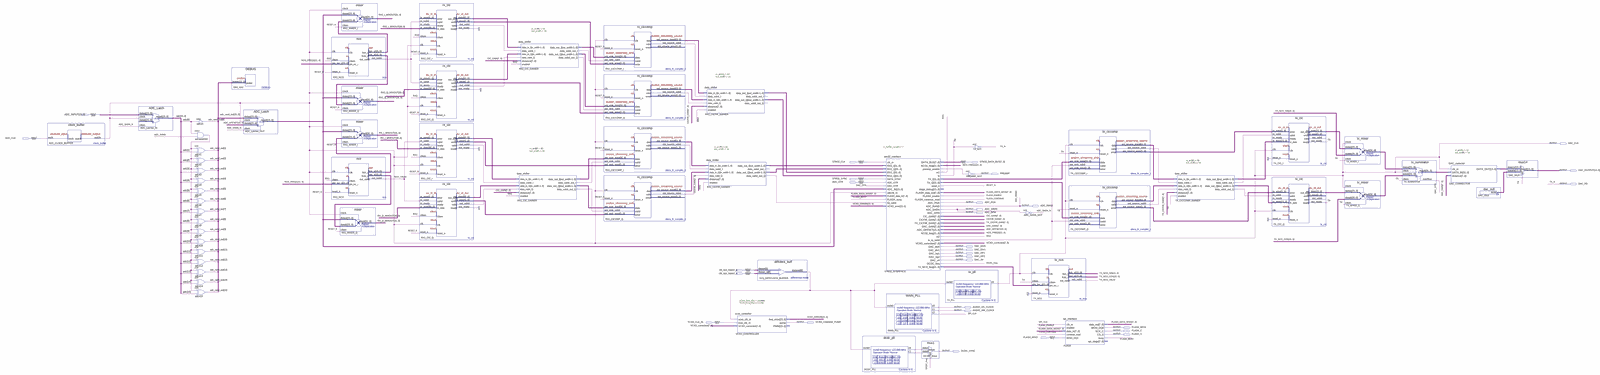
[diagram p0: schematic sheet, whole]
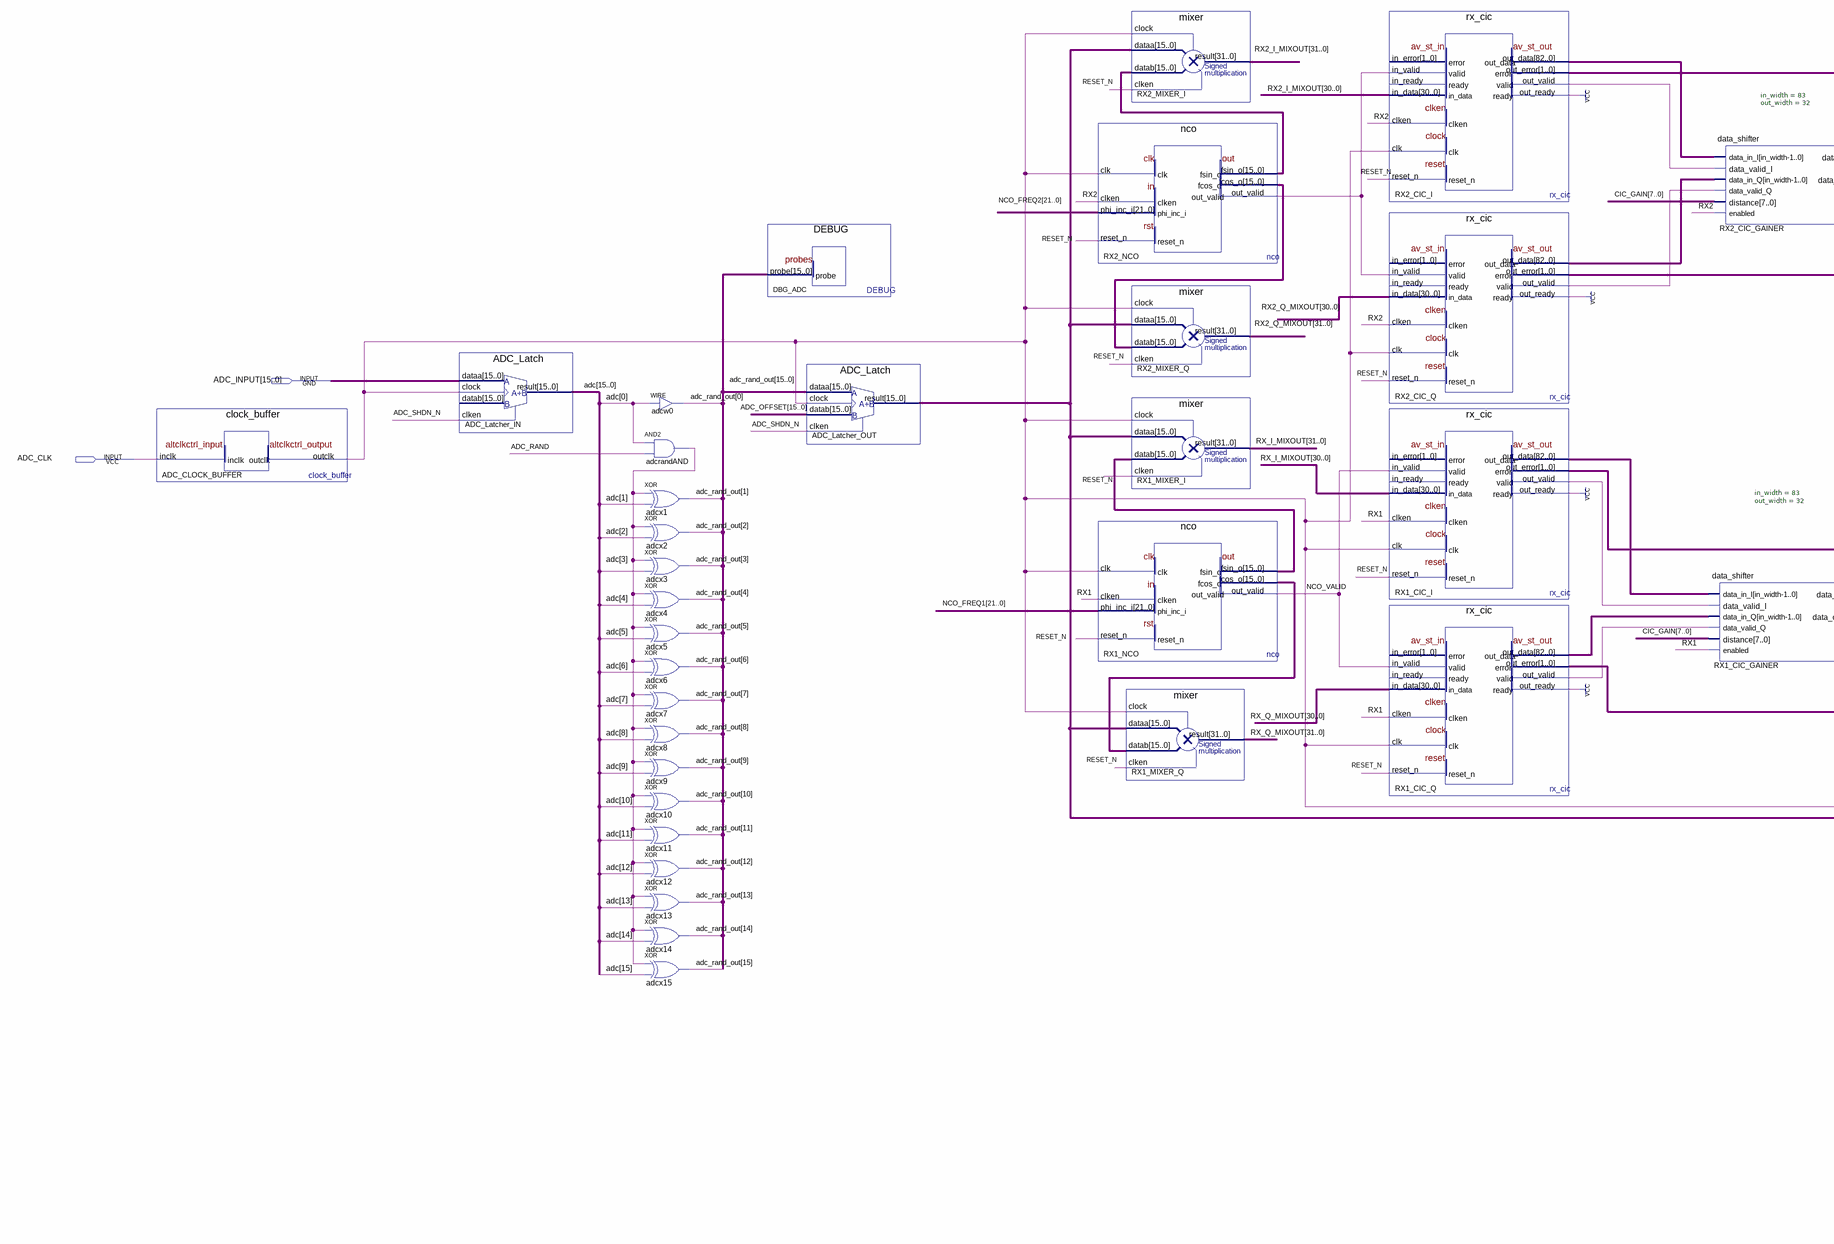
[diagram p1: schematic sheet, left part]
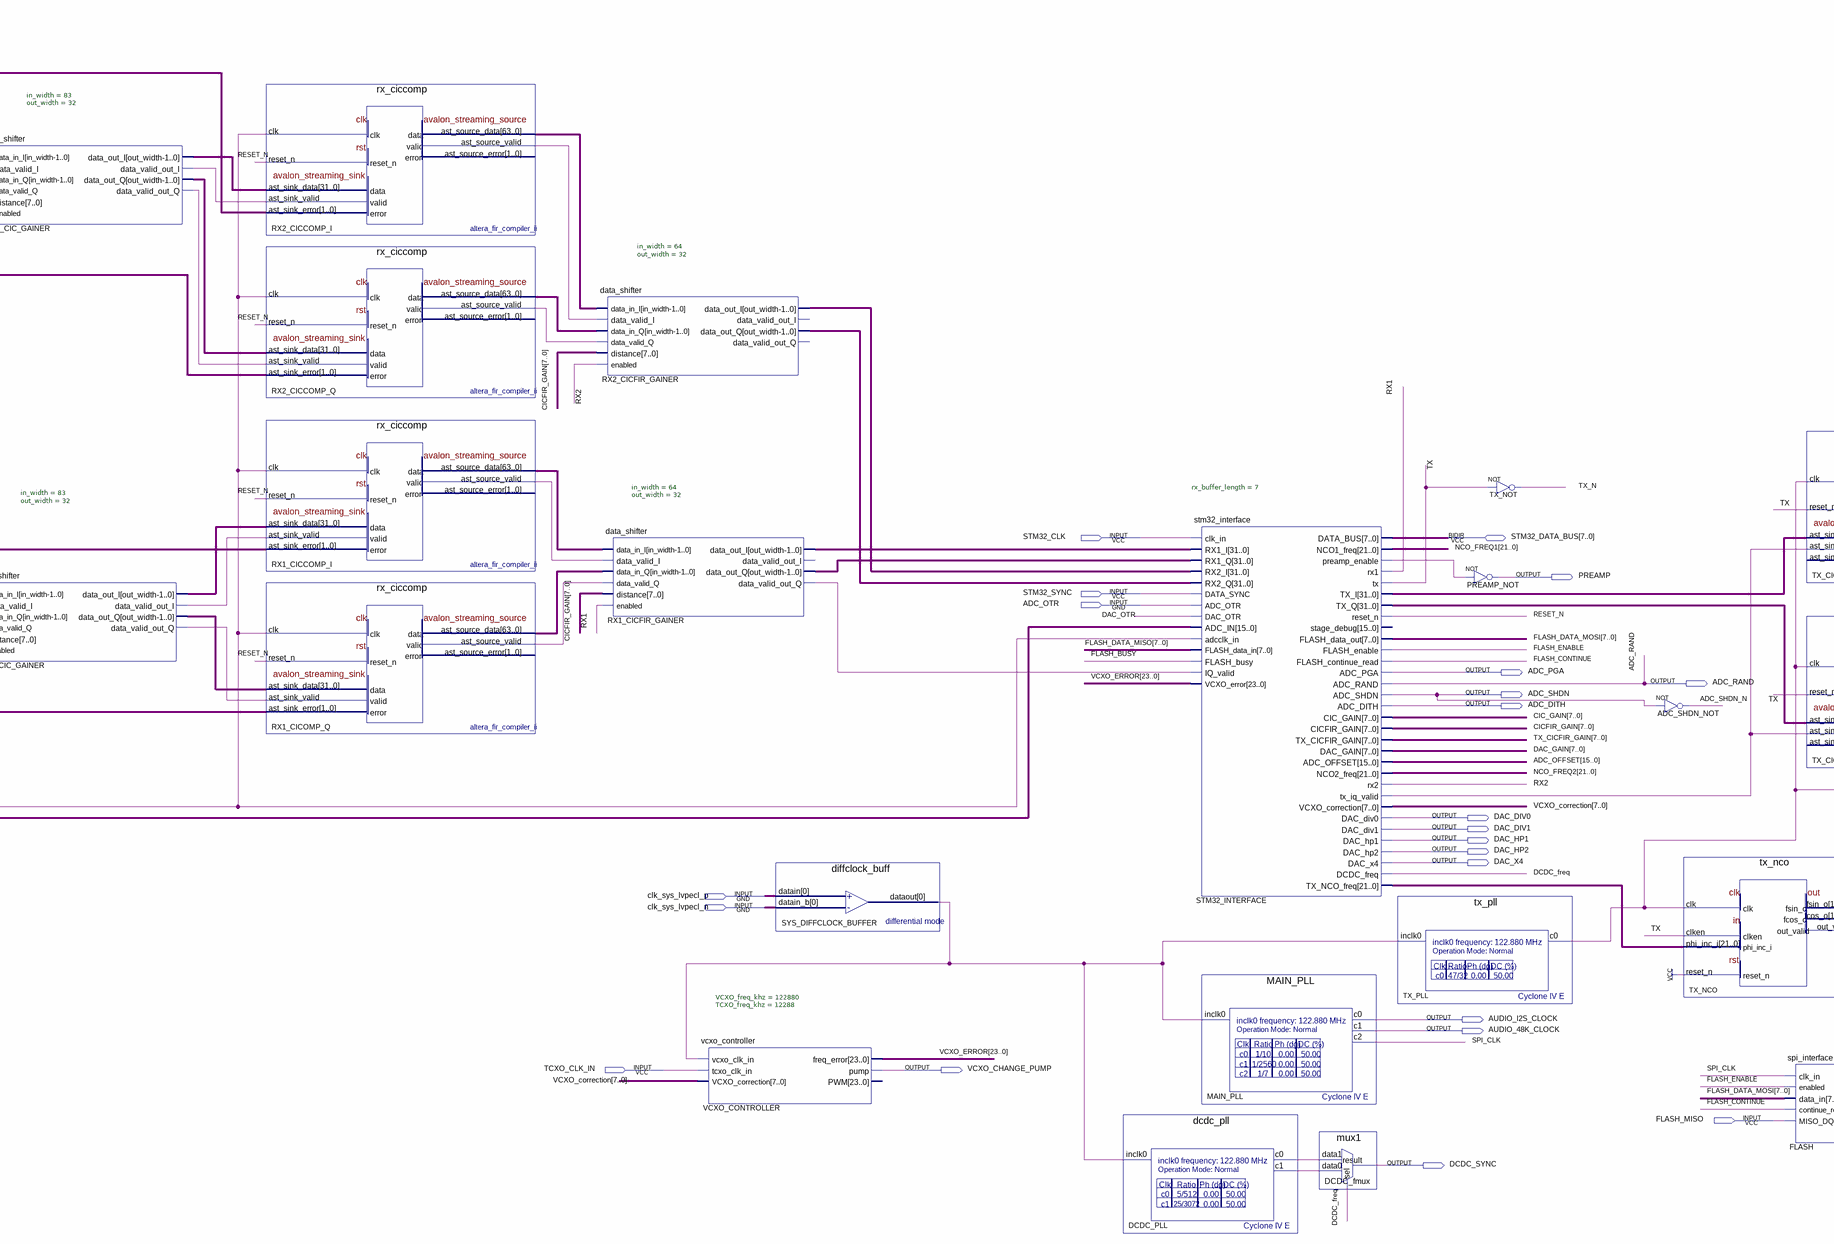
[diagram p2: schematic sheet, centre part]
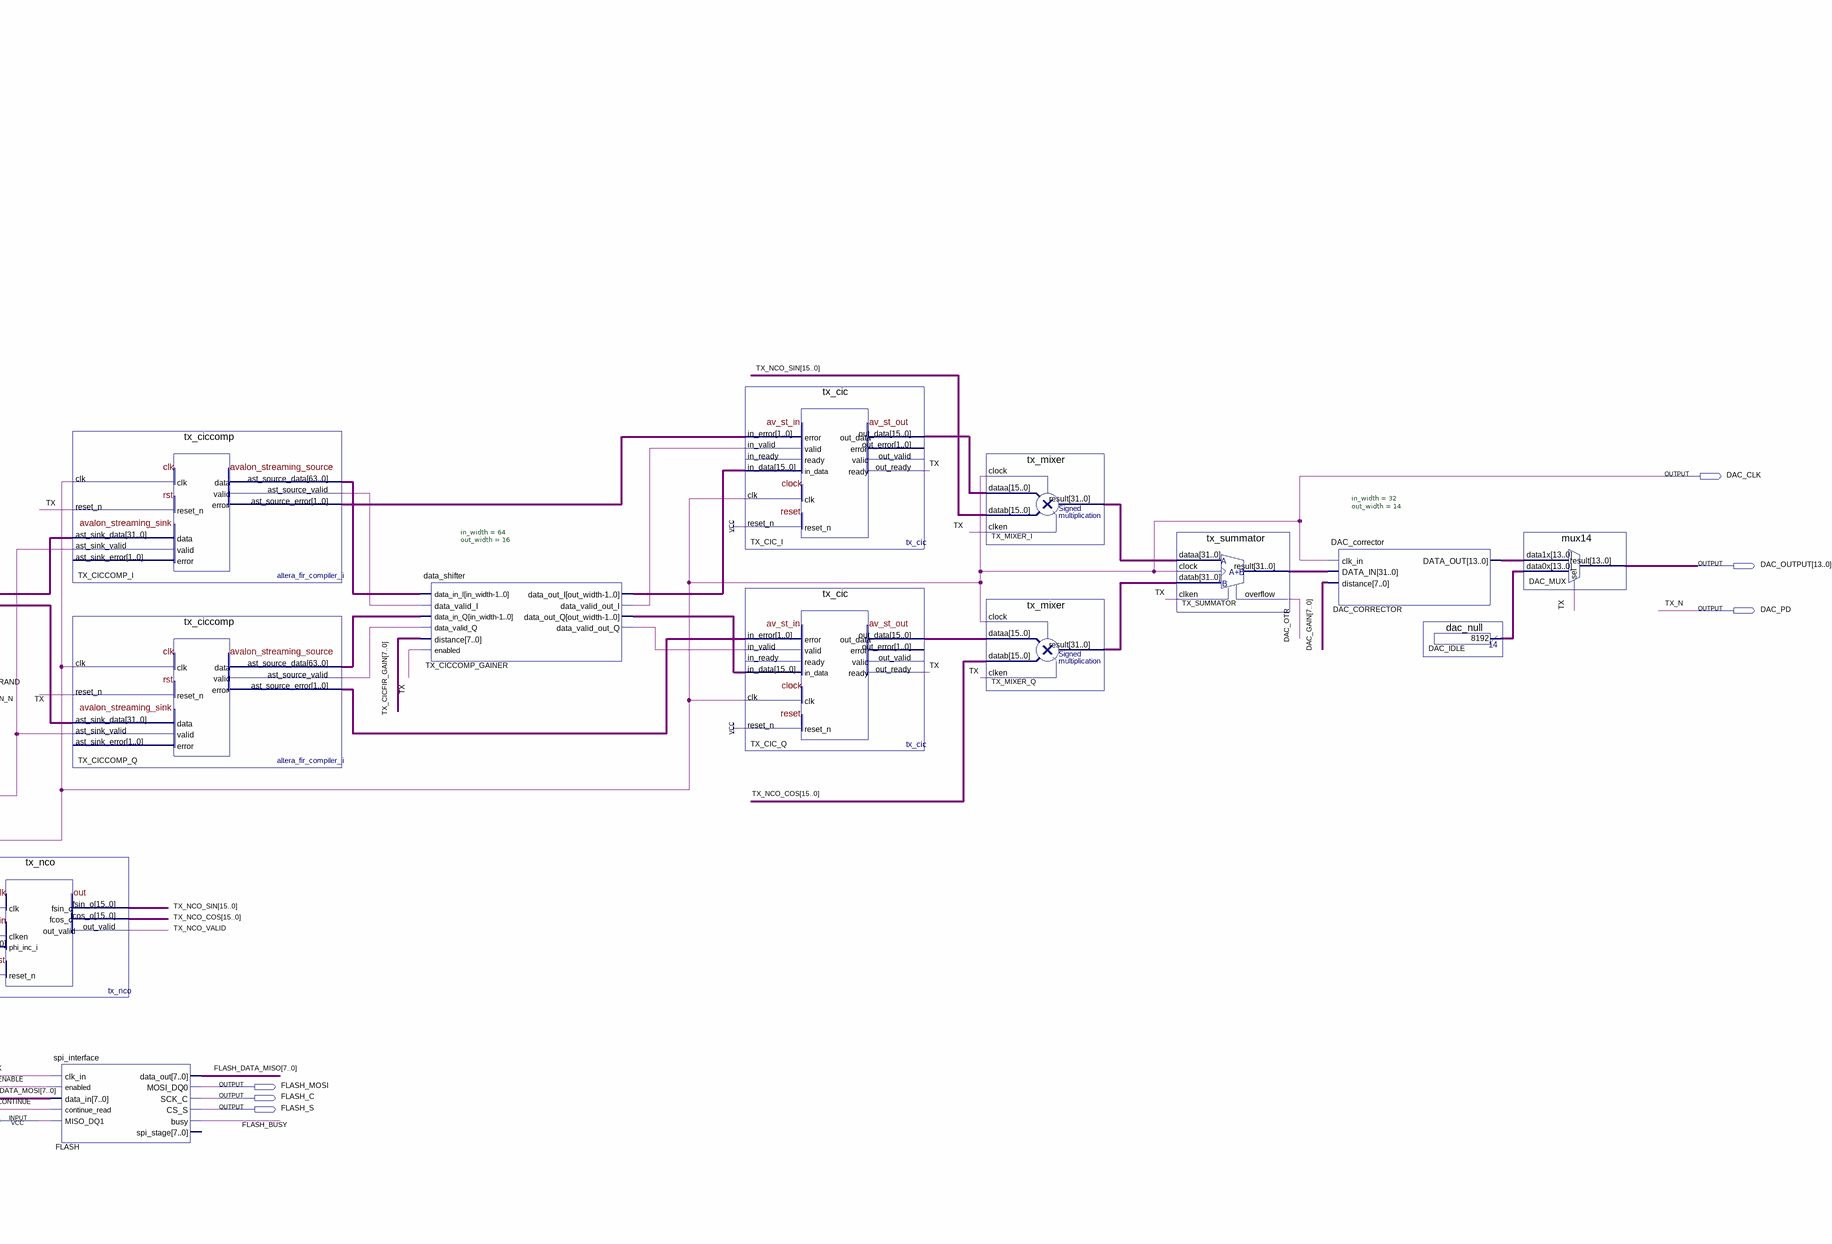
[diagram p3: schematic sheet, right part]
// Quartus schematic UA3REO.bdf as structural Verilog: 62 symbols, 30 pins
module UA3REO (
  input  [15:0] ADC_INPUT,
  input  ADC_CLK,
  input  STM32_CLK,
  input  STM32_SYNC,
  input  ADC_OTR,
  input  clk_sys_lvpecl_p,
  input  clk_sys_lvpecl_n,
  input  TCXO_CLK_IN,
  input  FLASH_MISO,
  inout  [7:0] STM32_DATA_BUS,
  output DAC_CLK,
  output [13:0] DAC_OUTPUT,
  output PREAMP,
  output DAC_PD,
  output ADC_PGA,
  output ADC_RAND,
  output ADC_SHDN,
  output ADC_DITH,
  output DAC_DIV0,
  output DAC_DIV1,
  output DAC_HP1,
  output DAC_HP2,
  output DAC_X4,
  output AUDIO_I2S_CLOCK,
  output AUDIO_48K_CLOCK,
  output VCXO_CHANGE_PUMP,
  output FLASH_MOSI,
  output FLASH_C,
  output FLASH_S,
  output DCDC_SYNC
);

  wire ADC_CLOCK_BUFFER_outclk, ADC_SHDN_N, adcrandAND_out, DAC_OTR, DCDC_freq, DCDC_PLL_c0, DCDC_PLL_c1,
       FLASH_BUSY, FLASH_CONTINUE, FLASH_ENABLE, NCO_VALID, RESET_N, RX1, RX1_CIC_GAINER_data_valid_out_i,
       RX1_CIC_GAINER_data_valid_out_q, RX1_CIC_I_out_valid, RX1_CIC_Q_out_valid,
       RX1_CICCOMP_I_ast_source_valid, RX1_CICFIR_GAINER_data_valid_out_q, RX1_CICOMP_Q_ast_source_valid,
       RX2, RX2_CIC_GAINER_data_valid_out_i, RX2_CIC_GAINER_data_valid_out_q, RX2_CIC_I_out_valid,
       RX2_CIC_Q_out_valid, RX2_CICCOMP_I_ast_source_valid, RX2_CICCOMP_Q_ast_source_valid,
       RX2_NCO_out_valid, SPI_CLK, STM32_INTERFACE_preamp_enable, STM32_INTERFACE_tx_iq_valid,
       SYS_DIFFCLOCK_BUFFER_dataout, TX, TX_CICCOMP_GAINER_data_valid_out_i,
       TX_CICCOMP_GAINER_data_valid_out_q, TX_CICCOMP_I_ast_source_valid, TX_CICCOMP_Q_ast_source_valid,
       TX_NCO_VALID;
  wire [1:0] RX1_CIC_I_out_error, RX1_CIC_Q_out_error, RX2_CIC_I_out_error, RX2_CIC_Q_out_error,
       TX_CICCOMP_I_ast_source_error, TX_CICCOMP_Q_ast_source_error;
  wire [7:0] CIC_GAIN, CICFIR_GAIN, DAC_GAIN, FLASH_DATA_MISO, FLASH_DATA_MOSI, TX_CICFIR_GAIN,
       VCXO_correction;
  wire [13:0] DAC_CORRECTOR_data_out, DAC_IDLE_result;
  wire [15:0] adc, ADC_Latcher_OUT_result, ADC_OFFSET, adc_rand_out, RX1_NCO_fcos_o, RX1_NCO_fsin_o,
       RX2_NCO_fcos_o, RX2_NCO_fsin_o, TX_CIC_I_out_data, TX_CIC_Q_out_data, TX_CICCOMP_GAINER_data_out_i,
       TX_CICCOMP_GAINER_data_out_q, TX_NCO_COS, TX_NCO_SIN;
  wire [21:0] NCO_FREQ1, NCO_FREQ2, STM32_INTERFACE_tx_nco_freq;
  wire [23:0] VCXO_ERROR;
  wire [31:0] RX1_CIC_GAINER_data_out_i, RX1_CIC_GAINER_data_out_q, RX1_CICFIR_GAINER_data_out_i,
       RX1_CICFIR_GAINER_data_out_q, RX2_CIC_GAINER_data_out_i, RX2_CIC_GAINER_data_out_q,
       RX2_CICFIR_GAINER_data_out_i, RX2_CICFIR_GAINER_data_out_q, RX2_I_MIXOUT, RX2_Q_MIXOUT, RX_I_MIXOUT,
       RX_Q_MIXOUT, STM32_INTERFACE_tx_i, STM32_INTERFACE_tx_q, TX_MIXER_I_result, TX_MIXER_Q_result,
       TX_SUMMATOR_result;
  wire [63:0] RX1_CICCOMP_I_ast_source_data, RX1_CICOMP_Q_ast_source_data, RX2_CICCOMP_I_ast_source_data,
       RX2_CICCOMP_Q_ast_source_data, TX_CICCOMP_I_ast_source_data, TX_CICCOMP_Q_ast_source_data;
  wire [82:0] RX1_CIC_I_out_data, RX1_CIC_Q_out_data, RX2_CIC_I_out_data, RX2_CIC_Q_out_data;

  clock_buffer ADC_CLOCK_BUFFER (.inclk(ADC_CLK), .outclk(ADC_CLOCK_BUFFER_outclk));
  ADC_Latch ADC_Latcher_IN (
    .dataa(ADC_INPUT), .clken(ADC_SHDN_N), .clock(ADC_CLOCK_BUFFER_outclk), .result(adc));  // open: datab
  assign adc_rand_out[0] = adc[0];  // WIRE adcw0
  and adcrandAND (adcrandAND_out, adc[0], ADC_RAND);
  xor adcx1 (adc_rand_out[1], adcrandAND_out, adc[1]);
  xor adcx2 (adc_rand_out[2], adcrandAND_out, adc[2]);
  xor adcx3 (adc_rand_out[3], adcrandAND_out, adc[3]);
  xor adcx4 (adc_rand_out[4], adcrandAND_out, adc[4]);
  xor adcx5 (adc_rand_out[5], adcrandAND_out, adc[5]);
  xor adcx6 (adc_rand_out[6], adcrandAND_out, adc[6]);
  xor adcx7 (adc_rand_out[7], adcrandAND_out, adc[7]);
  xor adcx8 (adc_rand_out[8], adcrandAND_out, adc[8]);
  xor adcx9 (adc_rand_out[9], adcrandAND_out, adc[9]);
  xor adcx10 (adc_rand_out[10], adcrandAND_out, adc[10]);
  xor adcx11 (adc_rand_out[11], adcrandAND_out, adc[11]);
  xor adcx12 (adc_rand_out[12], adcrandAND_out, adc[12]);
  xor adcx13 (adc_rand_out[13], adcrandAND_out, adc[13]);
  xor adcx14 (adc_rand_out[14], adcrandAND_out, adc[14]);
  xor adcx15 (adc_rand_out[15], adcrandAND_out, adc[15]);
  DEBUG DBG_ADC (.probe(adc_rand_out));
  ADC_Latch ADC_Latcher_OUT (
    .dataa(adc_rand_out), .datab(ADC_OFFSET), .clken(ADC_SHDN_N), .clock(ADC_CLOCK_BUFFER_outclk),
    .result(ADC_Latcher_OUT_result));
  nco RX2_NCO (
    .clk(ADC_CLOCK_BUFFER_outclk), .clken(RX2), .phi_inc_i(NCO_FREQ2), .reset_n(RESET_N),
    .fsin_o(RX2_NCO_fsin_o), .fcos_o(RX2_NCO_fcos_o), .out_valid(RX2_NCO_out_valid));
  nco RX1_NCO (
    .clk(ADC_CLOCK_BUFFER_outclk), .clken(RX1), .phi_inc_i(NCO_FREQ1), .reset_n(RESET_N),
    .fsin_o(RX1_NCO_fsin_o), .fcos_o(RX1_NCO_fcos_o), .out_valid(NCO_VALID));
  mixer RX2_MIXER_I (
    .clock(ADC_CLOCK_BUFFER_outclk), .dataa(ADC_Latcher_OUT_result), .datab(RX2_NCO_fsin_o), .clken(RESET_N),
    .result(RX2_I_MIXOUT));
  mixer RX2_MIXER_Q (
    .clock(ADC_CLOCK_BUFFER_outclk), .dataa(ADC_Latcher_OUT_result), .datab(RX2_NCO_fcos_o), .clken(RESET_N),
    .result(RX2_Q_MIXOUT));
  mixer RX1_MIXER_I (
    .clock(ADC_CLOCK_BUFFER_outclk), .dataa(ADC_Latcher_OUT_result), .datab(RX1_NCO_fsin_o), .clken(RESET_N),
    .result(RX_I_MIXOUT));
  mixer RX1_MIXER_Q (
    .clock(ADC_CLOCK_BUFFER_outclk), .dataa(ADC_Latcher_OUT_result), .datab(RX1_NCO_fcos_o), .clken(RESET_N),
    .result(RX_Q_MIXOUT));
  rx_cic RX2_CIC_I (
    .in_valid(RX2_NCO_out_valid), .in_data(RX2_I_MIXOUT[30:0]), .out_ready(1'b1), .clken(RX2),
    .clk(ADC_CLOCK_BUFFER_outclk), .reset_n(RESET_N), .out_data(RX2_CIC_I_out_data),
    .out_error(RX2_CIC_I_out_error), .out_valid(RX2_CIC_I_out_valid));  // open: in_error, in_ready
  rx_cic RX2_CIC_Q (
    .in_valid(RX2_NCO_out_valid), .in_data(RX2_Q_MIXOUT[30:0]), .out_ready(1'b1), .clken(RX2),
    .clk(ADC_CLOCK_BUFFER_outclk), .reset_n(RESET_N), .out_data(RX2_CIC_Q_out_data),
    .out_error(RX2_CIC_Q_out_error), .out_valid(RX2_CIC_Q_out_valid));  // open: in_error, in_ready
  rx_cic RX1_CIC_I (
    .in_valid(NCO_VALID), .in_data(RX_I_MIXOUT[30:0]), .out_ready(1'b1), .clken(RX1),
    .clk(ADC_CLOCK_BUFFER_outclk), .reset_n(RESET_N), .out_data(RX1_CIC_I_out_data),
    .out_error(RX1_CIC_I_out_error), .out_valid(RX1_CIC_I_out_valid));  // open: in_error, in_ready
  rx_cic RX1_CIC_Q (
    .in_valid(NCO_VALID), .in_data(RX_Q_MIXOUT[30:0]), .out_ready(1'b1), .clken(RX1),
    .clk(ADC_CLOCK_BUFFER_outclk), .reset_n(RESET_N), .out_data(RX1_CIC_Q_out_data),
    .out_error(RX1_CIC_Q_out_error), .out_valid(RX1_CIC_Q_out_valid));  // open: in_error, in_ready
  data_shifter #(.in_width(83), .out_width(32)) RX2_CIC_GAINER (
    .data_in_I(RX2_CIC_I_out_data), .data_valid_I(RX2_CIC_I_out_valid), .data_in_Q(RX2_CIC_Q_out_data),
    .data_valid_Q(RX2_CIC_Q_out_valid), .distance(CIC_GAIN), .enabled(RX2),
    .data_out_I(RX2_CIC_GAINER_data_out_i), .data_valid_out_I(RX2_CIC_GAINER_data_valid_out_i),
    .data_out_Q(RX2_CIC_GAINER_data_out_q), .data_valid_out_Q(RX2_CIC_GAINER_data_valid_out_q));
  data_shifter #(.in_width(83), .out_width(32)) RX1_CIC_GAINER (
    .data_in_I(RX1_CIC_I_out_data), .data_valid_I(RX1_CIC_I_out_valid), .data_in_Q(RX1_CIC_Q_out_data),
    .data_valid_Q(RX1_CIC_Q_out_valid), .distance(CIC_GAIN), .enabled(RX1),
    .data_out_I(RX1_CIC_GAINER_data_out_i), .data_valid_out_I(RX1_CIC_GAINER_data_valid_out_i),
    .data_out_Q(RX1_CIC_GAINER_data_out_q), .data_valid_out_Q(RX1_CIC_GAINER_data_valid_out_q));
  rx_ciccomp RX2_CICCOMP_I (
    .clk(ADC_CLOCK_BUFFER_outclk), .reset_n(RESET_N), .ast_sink_data(RX2_CIC_GAINER_data_out_i),
    .ast_sink_valid(RX2_CIC_GAINER_data_valid_out_i), .ast_sink_error(RX2_CIC_I_out_error),
    .ast_source_data(RX2_CICCOMP_I_ast_source_data), .ast_source_valid(RX2_CICCOMP_I_ast_source_valid));  // open: ast_source_error
  rx_ciccomp RX2_CICCOMP_Q (
    .clk(ADC_CLOCK_BUFFER_outclk), .reset_n(RESET_N), .ast_sink_data(RX2_CIC_GAINER_data_out_q),
    .ast_sink_valid(RX2_CIC_GAINER_data_valid_out_q), .ast_sink_error(RX2_CIC_Q_out_error),
    .ast_source_data(RX2_CICCOMP_Q_ast_source_data), .ast_source_valid(RX2_CICCOMP_Q_ast_source_valid));  // open: ast_source_error
  rx_ciccomp RX1_CICCOMP_I (
    .clk(ADC_CLOCK_BUFFER_outclk), .reset_n(RESET_N), .ast_sink_data(RX1_CIC_GAINER_data_out_i),
    .ast_sink_valid(RX1_CIC_GAINER_data_valid_out_i), .ast_sink_error(RX1_CIC_I_out_error),
    .ast_source_data(RX1_CICCOMP_I_ast_source_data), .ast_source_valid(RX1_CICCOMP_I_ast_source_valid));  // open: ast_source_error
  rx_ciccomp RX1_CICOMP_Q (
    .clk(ADC_CLOCK_BUFFER_outclk), .reset_n(RESET_N), .ast_sink_data(RX1_CIC_GAINER_data_out_q),
    .ast_sink_valid(RX1_CIC_GAINER_data_valid_out_q), .ast_sink_error(RX1_CIC_Q_out_error),
    .ast_source_data(RX1_CICOMP_Q_ast_source_data), .ast_source_valid(RX1_CICOMP_Q_ast_source_valid));  // open: ast_source_error
  data_shifter #(.in_width(64), .out_width(32)) RX2_CICFIR_GAINER (
    .data_in_I(RX2_CICCOMP_I_ast_source_data), .data_valid_I(RX2_CICCOMP_I_ast_source_valid),
    .data_in_Q(RX2_CICCOMP_Q_ast_source_data), .data_valid_Q(RX2_CICCOMP_Q_ast_source_valid),
    .distance(CICFIR_GAIN), .enabled(RX2), .data_out_I(RX2_CICFIR_GAINER_data_out_i),
    .data_out_Q(RX2_CICFIR_GAINER_data_out_q));  // open: data_valid_out_I, data_valid_out_Q
  data_shifter #(.in_width(64), .out_width(32)) RX1_CICFIR_GAINER (
    .data_in_I(RX1_CICCOMP_I_ast_source_data), .data_valid_I(RX1_CICCOMP_I_ast_source_valid),
    .data_in_Q(RX1_CICOMP_Q_ast_source_data), .data_valid_Q(RX1_CICOMP_Q_ast_source_valid),
    .distance(CICFIR_GAIN), .enabled(RX1), .data_out_I(RX1_CICFIR_GAINER_data_out_i),
    .data_out_Q(RX1_CICFIR_GAINER_data_out_q), .data_valid_out_Q(RX1_CICFIR_GAINER_data_valid_out_q));  // open: data_valid_out_I
  vcxo_controller #(.VCXO_freq_khz(122880), .TCXO_freq_khz(12288)) VCXO_CONTROLLER (
    .vcxo_clk_in(SYS_DIFFCLOCK_BUFFER_dataout), .tcxo_clk_in(TCXO_CLK_IN), .VCXO_correction(VCXO_correction),
    .freq_error(VCXO_ERROR), .pump(VCXO_CHANGE_PUMP));  // open: PWM
  diffclock_buff SYS_DIFFCLOCK_BUFFER (
    .datain(clk_sys_lvpecl_p), .datain_b(clk_sys_lvpecl_n), .dataout(SYS_DIFFCLOCK_BUFFER_dataout));
  dcdc_pll DCDC_PLL (.inclk0(SYS_DIFFCLOCK_BUFFER_dataout), .c0(DCDC_PLL_c0), .c1(DCDC_PLL_c1));
  stm32_interface #(.rx_buffer_length(7)) STM32_INTERFACE (
    .clk_in(STM32_CLK), .RX1_I(RX1_CICFIR_GAINER_data_out_i), .RX1_Q(RX1_CICFIR_GAINER_data_out_q),
    .RX2_I(RX2_CICFIR_GAINER_data_out_i), .RX2_Q(RX2_CICFIR_GAINER_data_out_q), .DATA_SYNC(STM32_SYNC),
    .ADC_OTR(ADC_OTR), .DAC_OTR(DAC_OTR), .ADC_IN(ADC_Latcher_OUT_result),
    .adcclk_in(ADC_CLOCK_BUFFER_outclk), .FLASH_data_in(FLASH_DATA_MISO), .FLASH_busy(FLASH_BUSY),
    .IQ_valid(RX1_CICFIR_GAINER_data_valid_out_q), .VCXO_error(VCXO_ERROR), .NCO1_freq(NCO_FREQ1),
    .preamp_enable(STM32_INTERFACE_preamp_enable), .rx1(RX1), .tx(TX), .TX_I(STM32_INTERFACE_tx_i),
    .TX_Q(STM32_INTERFACE_tx_q), .reset_n(RESET_N), .FLASH_data_out(FLASH_DATA_MOSI),
    .FLASH_enable(FLASH_ENABLE), .FLASH_continue_read(FLASH_CONTINUE), .ADC_PGA(ADC_PGA),
    .ADC_RAND(ADC_RAND), .ADC_SHDN(ADC_SHDN), .ADC_DITH(ADC_DITH), .CIC_GAIN(CIC_GAIN),
    .CICFIR_GAIN(CICFIR_GAIN), .TX_CICFIR_GAIN(TX_CICFIR_GAIN), .DAC_GAIN(DAC_GAIN), .ADC_OFFSET(ADC_OFFSET),
    .NCO2_freq(NCO_FREQ2), .rx2(RX2), .tx_iq_valid(STM32_INTERFACE_tx_iq_valid),
    .VCXO_correction(VCXO_correction), .DAC_div0(DAC_DIV0), .DAC_div1(DAC_DIV1), .DAC_hp1(DAC_HP1),
    .DAC_hp2(DAC_HP2), .DAC_x4(DAC_X4), .DCDC_freq(DCDC_freq), .TX_NCO_freq(STM32_INTERFACE_tx_nco_freq),
    .DATA_BUS(STM32_DATA_BUS));  // open: stage_debug
  MAIN_PLL MAIN_PLL (.inclk0(SYS_DIFFCLOCK_BUFFER_dataout), .c0(AUDIO_I2S_CLOCK), .c1(AUDIO_48K_CLOCK), .c2(SPI_CLK));
  mux1 DCDC_fmux (.data1(DCDC_PLL_c0), .data0(DCDC_PLL_c1), .sel(DCDC_freq), .result(DCDC_SYNC));
  tx_pll TX_PLL (.inclk0(SYS_DIFFCLOCK_BUFFER_dataout), .c0(DAC_CLK));
  not TX_NOT (DAC_PD, TX);
  not PREAMP_NOT (PREAMP, STM32_INTERFACE_preamp_enable);
  not ADC_SHDN_NOT (ADC_SHDN_N, ADC_SHDN);
  tx_nco TX_NCO (
    .clk(DAC_CLK), .clken(TX), .phi_inc_i(STM32_INTERFACE_tx_nco_freq), .reset_n(1'b1), .fsin_o(TX_NCO_SIN),
    .fcos_o(TX_NCO_COS), .out_valid(TX_NCO_VALID));
  spi_interface FLASH (
    .clk_in(SPI_CLK), .enabled(FLASH_ENABLE), .data_in(FLASH_DATA_MOSI), .continue_read(FLASH_CONTINUE),
    .MISO_DQ1(FLASH_MISO), .data_out(FLASH_DATA_MISO), .MOSI_DQ0(FLASH_MOSI), .SCK_C(FLASH_C),
    .CS_S(FLASH_S), .busy(FLASH_BUSY));  // open: spi_stage
  tx_ciccomp TX_CICCOMP_I (
    .clk(DAC_CLK), .reset_n(TX), .ast_sink_data(STM32_INTERFACE_tx_i),
    .ast_sink_valid(STM32_INTERFACE_tx_iq_valid), .ast_source_data(TX_CICCOMP_I_ast_source_data),
    .ast_source_valid(TX_CICCOMP_I_ast_source_valid), .ast_source_error(TX_CICCOMP_I_ast_source_error));  // open: ast_sink_error
  tx_ciccomp TX_CICCOMP_Q (
    .clk(DAC_CLK), .reset_n(TX), .ast_sink_data(STM32_INTERFACE_tx_q),
    .ast_sink_valid(STM32_INTERFACE_tx_iq_valid), .ast_source_data(TX_CICCOMP_Q_ast_source_data),
    .ast_source_valid(TX_CICCOMP_Q_ast_source_valid), .ast_source_error(TX_CICCOMP_Q_ast_source_error));  // open: ast_sink_error
  data_shifter #(.in_width(64), .out_width(16)) TX_CICCOMP_GAINER (
    .data_in_I(TX_CICCOMP_I_ast_source_data), .data_valid_I(TX_CICCOMP_I_ast_source_valid),
    .data_in_Q(TX_CICCOMP_Q_ast_source_data), .data_valid_Q(TX_CICCOMP_Q_ast_source_valid),
    .distance(TX_CICFIR_GAIN), .enabled(TX), .data_out_I(TX_CICCOMP_GAINER_data_out_i),
    .data_valid_out_I(TX_CICCOMP_GAINER_data_valid_out_i), .data_out_Q(TX_CICCOMP_GAINER_data_out_q),
    .data_valid_out_Q(TX_CICCOMP_GAINER_data_valid_out_q));
  tx_cic TX_CIC_I (
    .in_error(TX_CICCOMP_I_ast_source_error), .in_valid(TX_CICCOMP_GAINER_data_valid_out_i),
    .in_data(TX_CICCOMP_GAINER_data_out_i), .out_ready(TX), .clk(DAC_CLK), .reset_n(1'b1),
    .out_data(TX_CIC_I_out_data));  // open: in_ready, out_error, out_valid
  tx_cic TX_CIC_Q (
    .in_error(TX_CICCOMP_Q_ast_source_error), .in_valid(TX_CICCOMP_GAINER_data_valid_out_q),
    .in_data(TX_CICCOMP_GAINER_data_out_q), .out_ready(TX), .clk(DAC_CLK), .reset_n(1'b1),
    .out_data(TX_CIC_Q_out_data));  // open: in_ready, out_error, out_valid
  tx_mixer TX_MIXER_I (
    .clock(DAC_CLK), .dataa(TX_CIC_I_out_data), .datab(TX_NCO_SIN), .clken(TX), .result(TX_MIXER_I_result));
  tx_mixer TX_MIXER_Q (
    .clock(DAC_CLK), .dataa(TX_CIC_Q_out_data), .datab(TX_NCO_COS), .clken(TX), .result(TX_MIXER_Q_result));
  tx_summator TX_SUMMATOR (
    .dataa(TX_MIXER_I_result), .datab(TX_MIXER_Q_result), .clken(TX), .clock(DAC_CLK),
    .result(TX_SUMMATOR_result), .overflow(DAC_OTR));
  DAC_corrector #(.in_width(32), .out_width(14)) DAC_CORRECTOR (
    .clk_in(DAC_CLK), .DATA_IN(TX_SUMMATOR_result), .distance(DAC_GAIN), .DATA_OUT(DAC_CORRECTOR_data_out));
  dac_null DAC_IDLE (.result(DAC_IDLE_result));
  mux14 DAC_MUX (.data1x(DAC_CORRECTOR_data_out), .data0x(DAC_IDLE_result), .sel(TX), .result(DAC_OUTPUT));

  // Other names for the same wires on the sheet: TX_N = DAC_PD
endmodule
